# EAGLE design untitled (EAGLE 5.12)
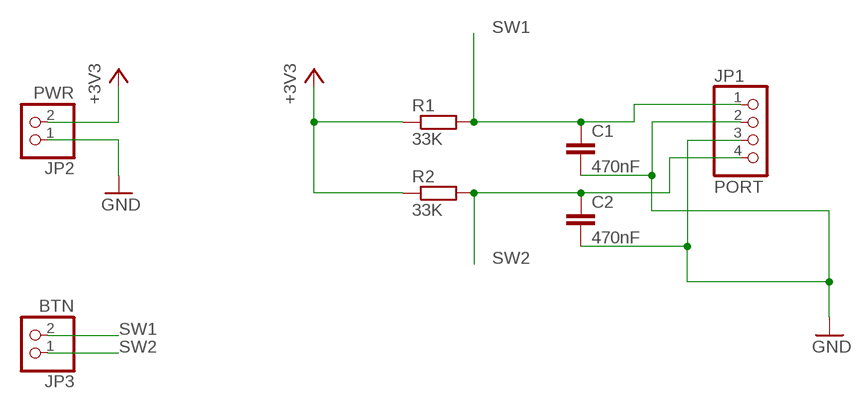
[diagram p0: schematic, sheet 1]

## Parts
C1  470nF  C-EU025-030X050  [C025-030X050]
C2  470nF  C-EU025-030X050  [C025-030X050]
JP1  PORT  PINHD-1X4  [1X04]
JP2  PWR  PINHD-1X2  [1X02]
JP3  BTN  PINHD-1X2  [1X02]
R1  33K  R-EU_0207/5V  [0207/5V]
R2  33K  R-EU_0207/5V  [0207/5V]

## Nets
+3V3: JP2.2 R1.1 R2.1
GND: C1.2 C2.2 JP1.2 JP1.3 JP2.1
SW1: C1.1 JP1.1 JP3.2 R1.2
SW2: C2.1 JP1.4 JP3.1 R2.2

## Library data of the parts
C1 C2 = rcl:C-EU: CAPACITOR, European symbol
JP1 = pinhead:PINHD-1X4: PIN HEADER
JP2 JP3 = pinhead:PINHD-1X2: PIN HEADER
R1 R2 = rcl:R-EU_: RESISTOR, European symbol

## Board
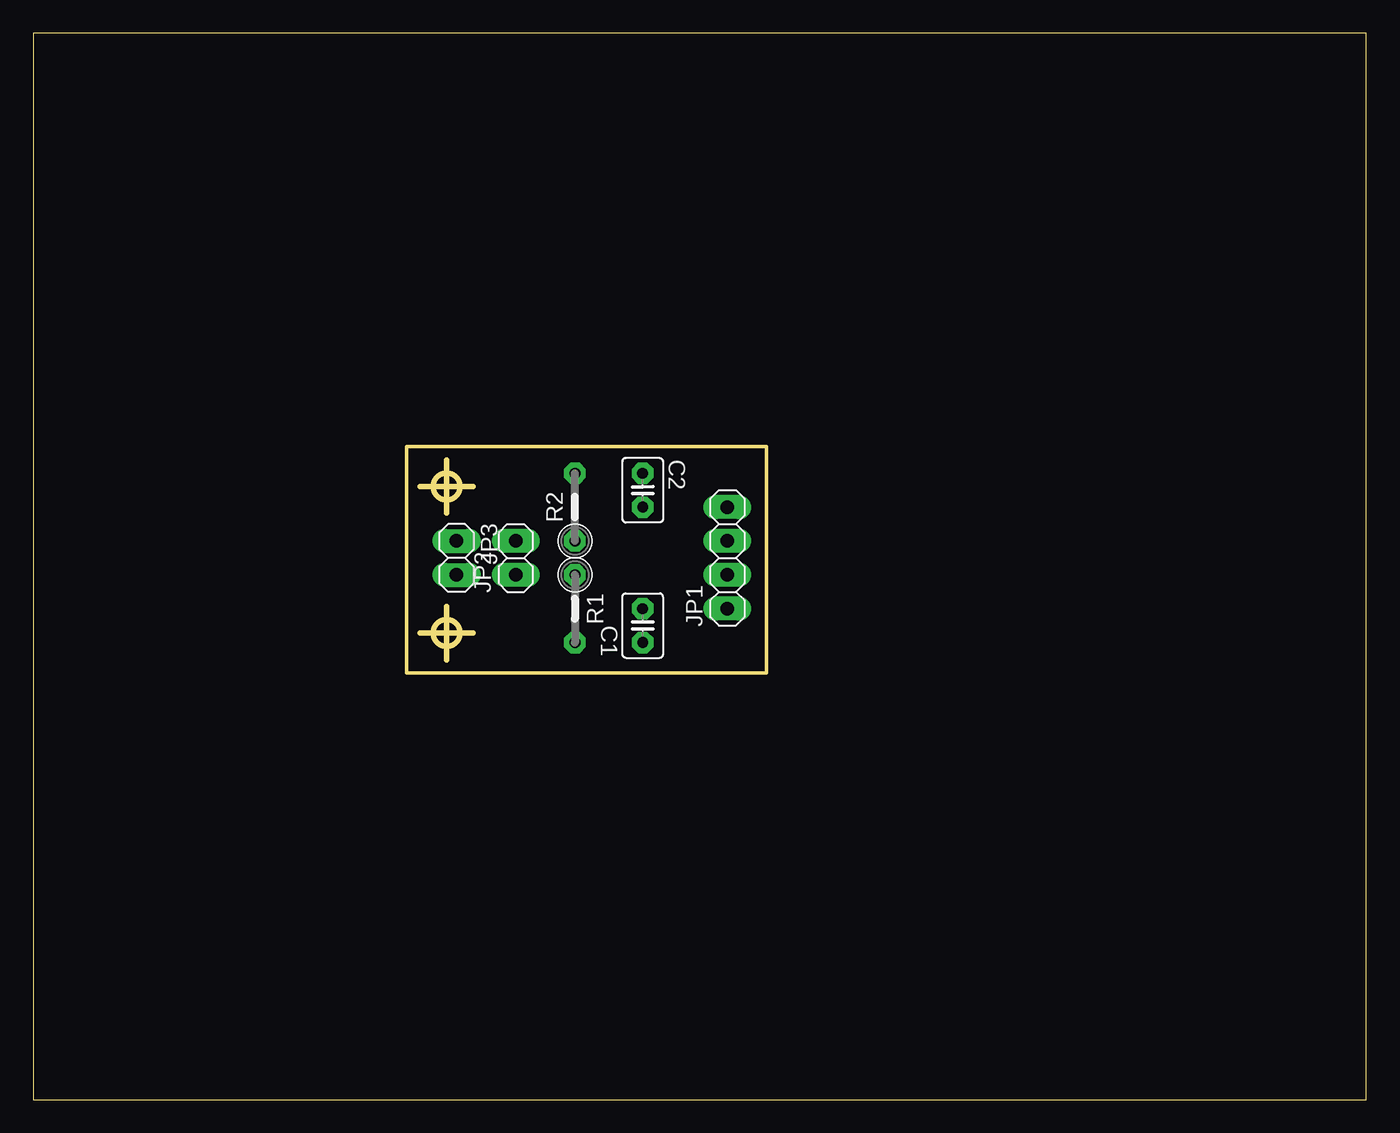
[diagram p1: board, top side]
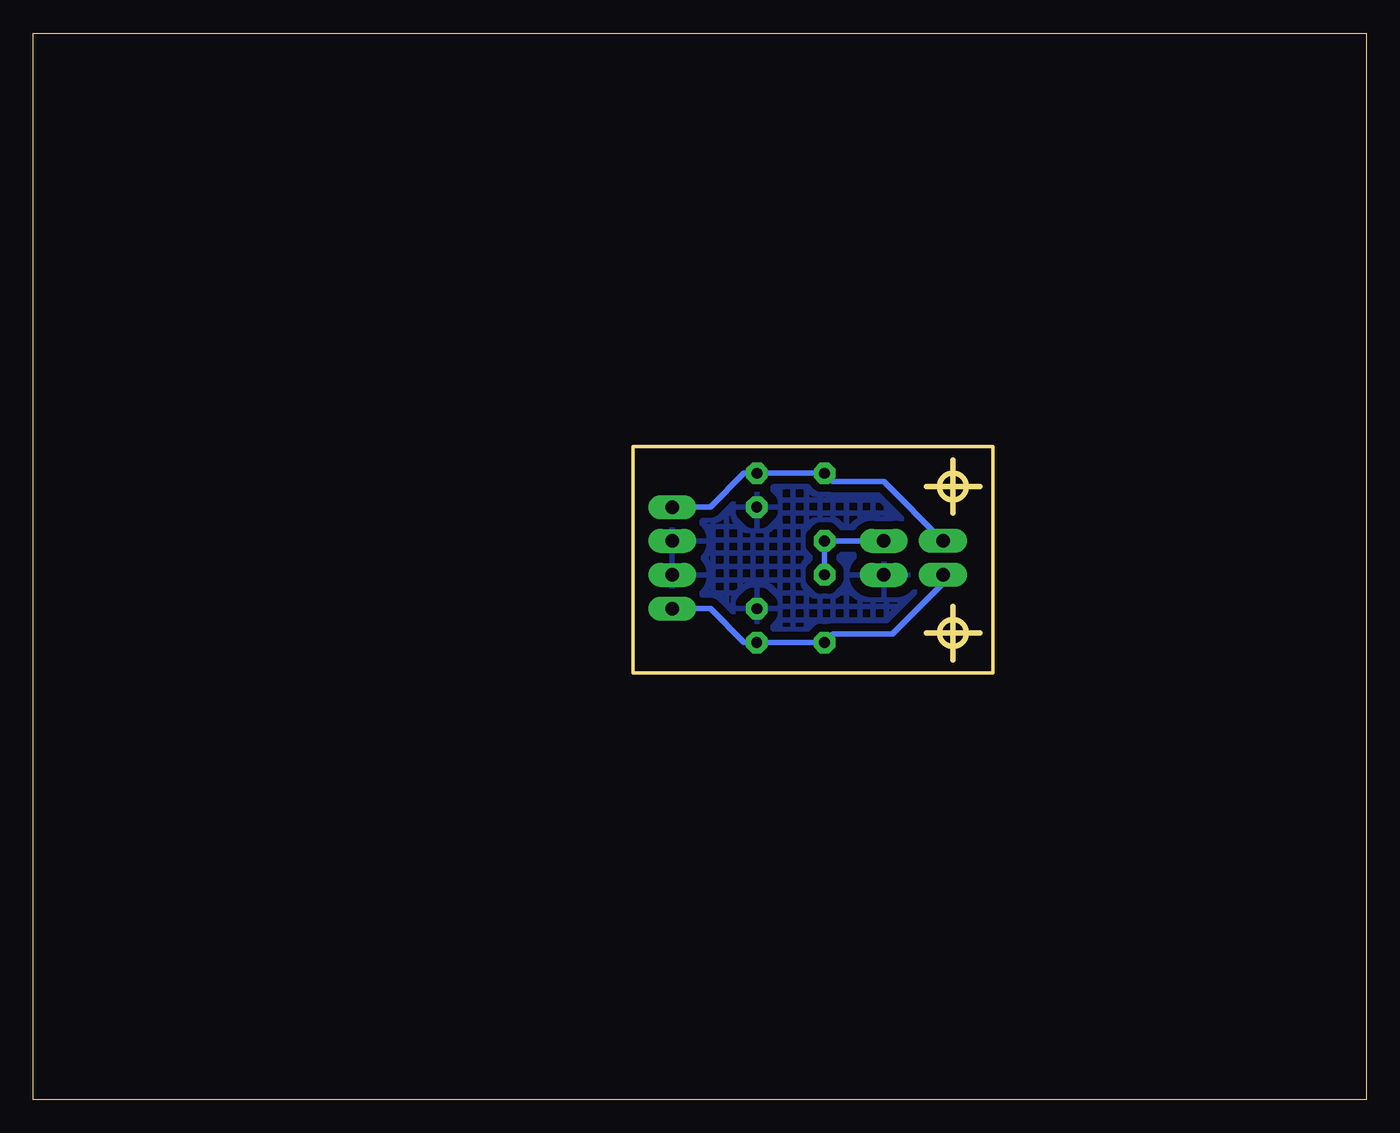
[diagram p2: board, bottom side, seen from below]

Size 100 x 80 mm. Coordinates in mm from the lower left corner, seen from the top.
Outline: 29,35 33,35
Outline: 31,37 31,33
Outline: 31,44 31,48
Outline: 29,46 33,46
Outline: 0,0 100,0 100,80 0,80 0,0
Outline: 28,49 55,49 55,32 28,32 28,49
Outline: circle at 31,46 radius 1
Outline: circle at 31,35 radius 1
Copper layers (1*16): Top 0.035mm / dielectric 1.5mm / Bottom 0.035mm
Design rules "default *": minimum track width 0.4mm, minimum drill 0.8mm, track to track 0.6mm, track to pad 0.6mm, pad to pad 0.6mm, via to via 0.6mm, smd to smd 8mil, copper to edge 40mil, drill to drill 8mil, minimum pad ring 0.4mm, minimum via ring 8mil, stop-mask expansion 4mil, vias tented up to drill 0mil, thermal gap 30mil

### Footprints (pad centres in the part's own frame; a part is rotated, then mirrored left to right if it is on the bottom)
C025-030X050 = drill 0.813 octagon: 1 -1.27,0; 2 1.27,0
1X04 = drill 1.016 long: 1 -3.81,0; 2 -1.27,0; 3 1.27,0; 4 3.81,0
1X02 = drill 1.016 long: 1 -1.27,0; 2 1.27,0
0207/5V = drill 0.813 octagon: 1 -2.54,0; 2 2.54,0

### Placement (x,y rotation side)
C1  45.72,35.56 90.1 top
C2  45.72,45.72 270.1 top
JP1  52.07,40.64 90 top
JP2  36.2,40.64 90 top
JP3  31.75,40.64 270 top
R1  40.64,36.83 270 top
R2  40.64,44.45 90 top

### Tracks (layer width: path | path; a pad name or v marks a point on that pad's centre or on a via)
+3V3
  Bottom 0.4: R1.1 R2.1 JP2.2
GND
  pour Bottom (hatched): 31.75,47.62 31.75,33.66 52.07,33.66 52.07,47.62
SW1
  Bottom 0.4: JP3.2 31.75,38.73 35.56,34.92 40.01,34.92 R1.2 C1.1 46.67,34.29 49.21,36.83 JP1.1
SW2
  Bottom 0.4: JP3.1 36.2,46.35 40.01,46.35 R2.2 45.4,46.99 C2.1 46.67,46.99 49.21,44.45 JP1.4